# EAGLE schematic LCmeter0-hd44780 (EAGLE 7.3.0)
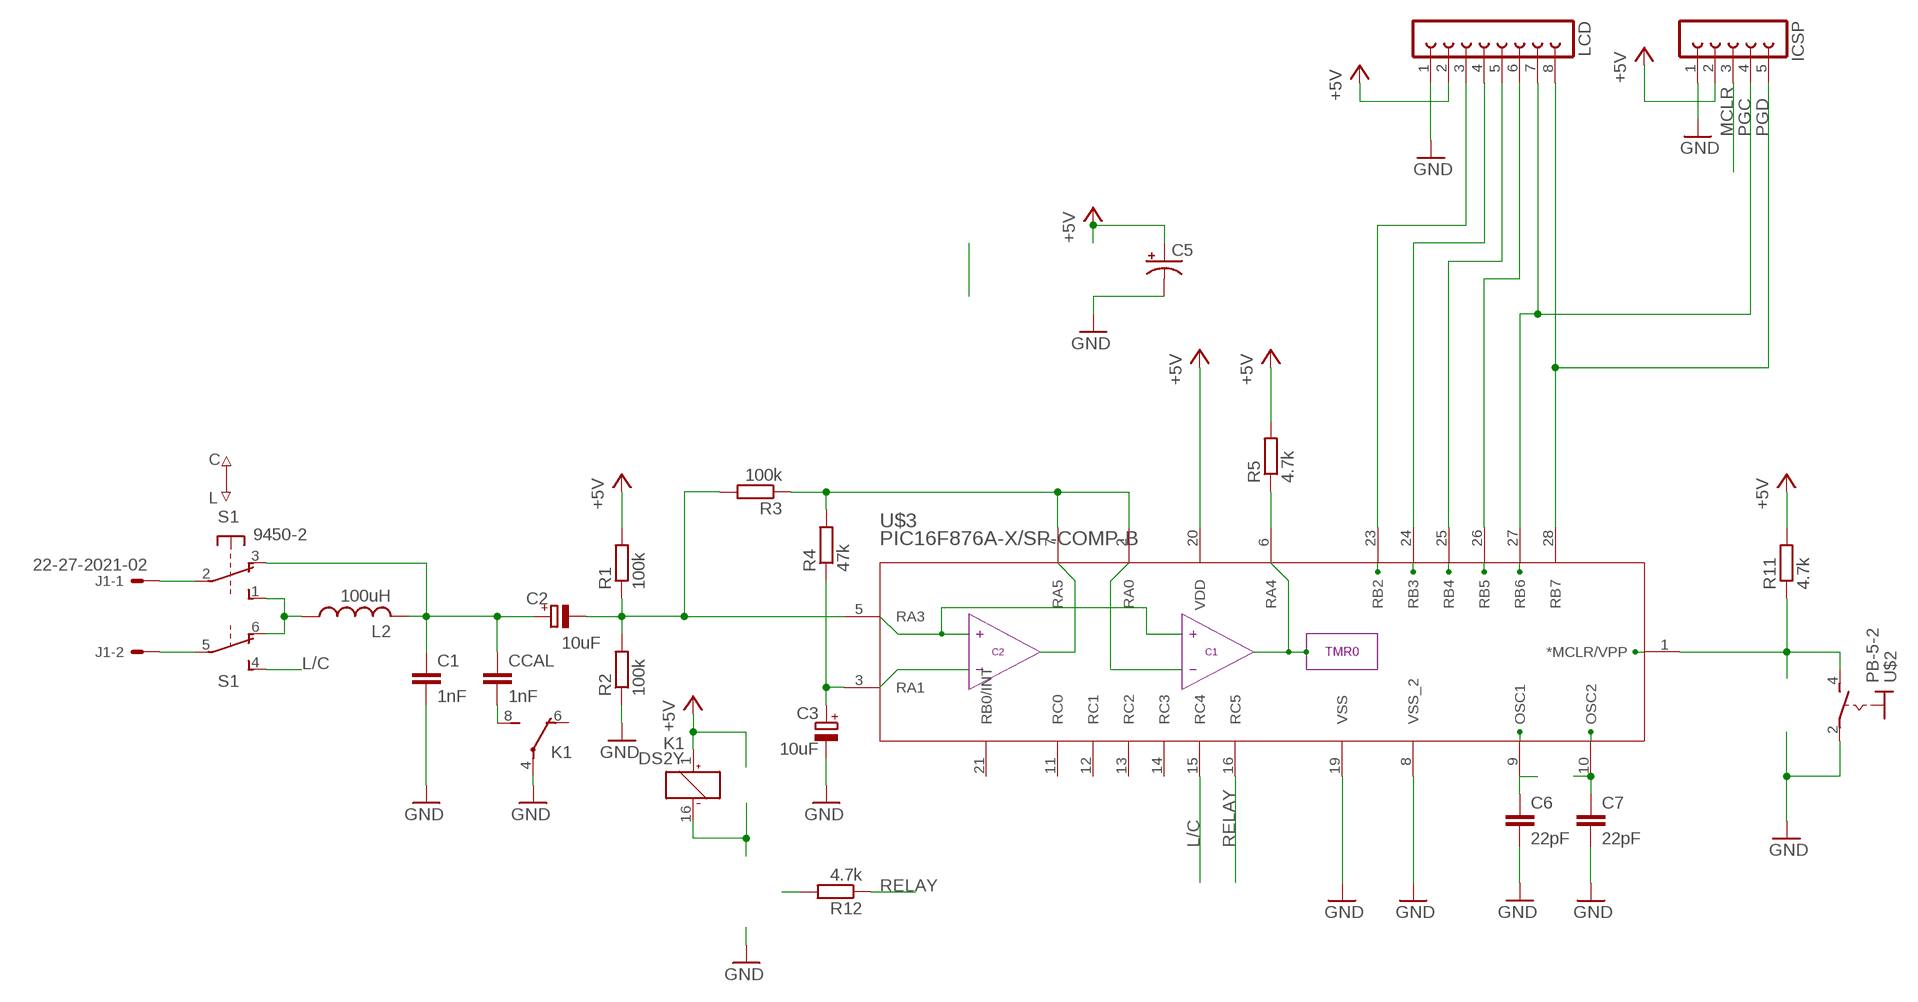
[diagram p0: schematic, sheet 1]

## Parts
C1  1nF  C-EU050-025X075  [C050-025X075]
C2  10uF  CPOL-EUE5-4  [E5-4]
C3  10uF  CPOL-EUE5-5  [E5-5]
C5  CPOL-USE2,5-6E  [E2,5-6E]
C6  22pF  C-EU050-024X044  [C050-024X044]
C7  22pF  C-EU050-024X044  [C050-024X044]
CCAL  1nF  C-EU050-025X075  [C050-025X075]
ICSP  FE05-1  [FE05-1]
J1  22-27-2021-02  [6410-02]
K1  DS2Y  DS2Y-S-DC5V  [DS2Y]
L2  100uH  L-US0204/7  [0204/7]
LCD  FE08-1  [FE08]
R1  100k  R-EU_0204/2V  [0204V]
R2  100k  R-EU_0204/2V  [0204V]
R3  100k  R-EU_0204/7  [0204/7]
R4  47k  R-EU_0204/2V  [0204V]
R5  4.7k  R-EU_0204/5  [0204/5]
R11  4.7k  R-EU_0204/2V  [0204V]
R12  4.7k  R-EU_0207/10  [0207/10]
S1  9450-2  [9450-2]
U$2  PB-5-2  [PB-5-1]
U$3  PIC16F876A-X/SP-COMP-B  [DIL28-3]

## Nets
+5V: C4.1 C5.+ D1.C ICSP.2 K1.1(1:+) LCD.2 R1.2 R5.2 R11.2 U$3.20(VDD)
GND: C1.2 C3.- C4.2 C5.- C6.2 C7.2 ICSP.1 K1.4(2:P) R2.1 T1.E U$2.2(P) U$3.8(VSS_2) U$3.19(VSS)
L/C: S1.4(2:S) U$3.15(RC4)
MCLR: ICSP.3 R11.1 U$2.4(S) U$3.1(*MCLR/VPP)
N$1: LCD.3 U$3.23(RB2)
N$2: LCD.4 U$3.24(RB3)
N$3: LCD.5 U$3.25(RB4)
N$4: LCD.6 U$3.26(RB5)
N$5: J1.1 S1.2(1:P)
N$6: R5.1 U$3.6(RA4)
N$7: LCD.1 ; supply symbol labelled GND
N$8: J1.2 S1.5(2:P)
N$9: C7.1 Q1.2 U$3.10(OSC2)
N$10: C6.1 Q1.1 U$3.9(OSC1)
N$17: R3.1 R4.2 U$3.2(RA0) U$3.7(RA5)
N$19: R12.2 T1.B
N$20: D1.A K1.16(1:-) T1.C
N$21: CCAL.2 K1.8(2:S)
N$23: C1.1 C2.+ CCAL.1 L2.2 S1.3(1:O)
N$24: L2.1 S1.1(1:S) S1.6(2:O)
PGC: ICSP.4 LCD.7 U$3.27(RB6)
PGD: ICSP.5 LCD.8 U$3.28(RB7)
RA1: C3.+ R4.1 U$3.3(RA1)
RA3: C2.- R1.1 R2.2 R3.2 U$3.5(RA3)
RELAY: R12.1 U$3.16(RC5)
Unconnected: K1.6(2:O) K1.9(3:S) K1.11(3:O) K1.13(3:P) U$3.11(RC0) U$3.12(RC1) U$3.13(RC2) U$3.14(RC3) U$3.21(RB0/INT)

## Notes on the sheet
- C
- L

## Library data of the parts
C1 C6 C7 CCAL = rcl:C-EU: CAPACITOR, European symbol
C2 C3 = rcl:CPOL-EU: POLARIZED CAPACITOR, European symbol
C5 = rcl:CPOL-US: POLARIZED CAPACITOR, American symbol
ICSP = con-lsta:FE05-1: FEMALE HEADER; OC_FARNELL: unknown; OC_NEWARK: unknown
J1 = con-molex:22-?-02: CONNECTOR wire to board 2.54 mm (.1 inch) pitch header; OC_FARNELL: unknown; OC_NEWARK: unknown
K1 = relay:DS2Y-S-DC*: MINIATURE RELAY NAiS Source: http://www.mew-europe.com/.. en_ds_61005_0023.pdf; MPN: DS2Y-S-DC5V; OC_FARNELL: unknown; OC_NEWARK: 13P3268
L2 = rcl:L-US: INDUCTOR, American symbol
LCD = con-lsta:FE08-1: FEMALE HEADER; OC_FARNELL: unknown; OC_NEWARK: unknown
R1-R5 R11 R12 = rcl:R-EU_: RESISTOR, European symbol
S1 = switch-misc:9450-2: MARQUARDT SWITCH
U$2 = mcu:PB-5-2
U$3 = mcu:PIC16F876A-X/SP-COMP-B